# Altium schematic sheet Connectors.SchDoc
size Letter; Organization: Altium Limited; Address1: L3, 12a Rodborough Rd; Address2: Frenchs Forest; Address3: NSW; Address4: Australia 2086
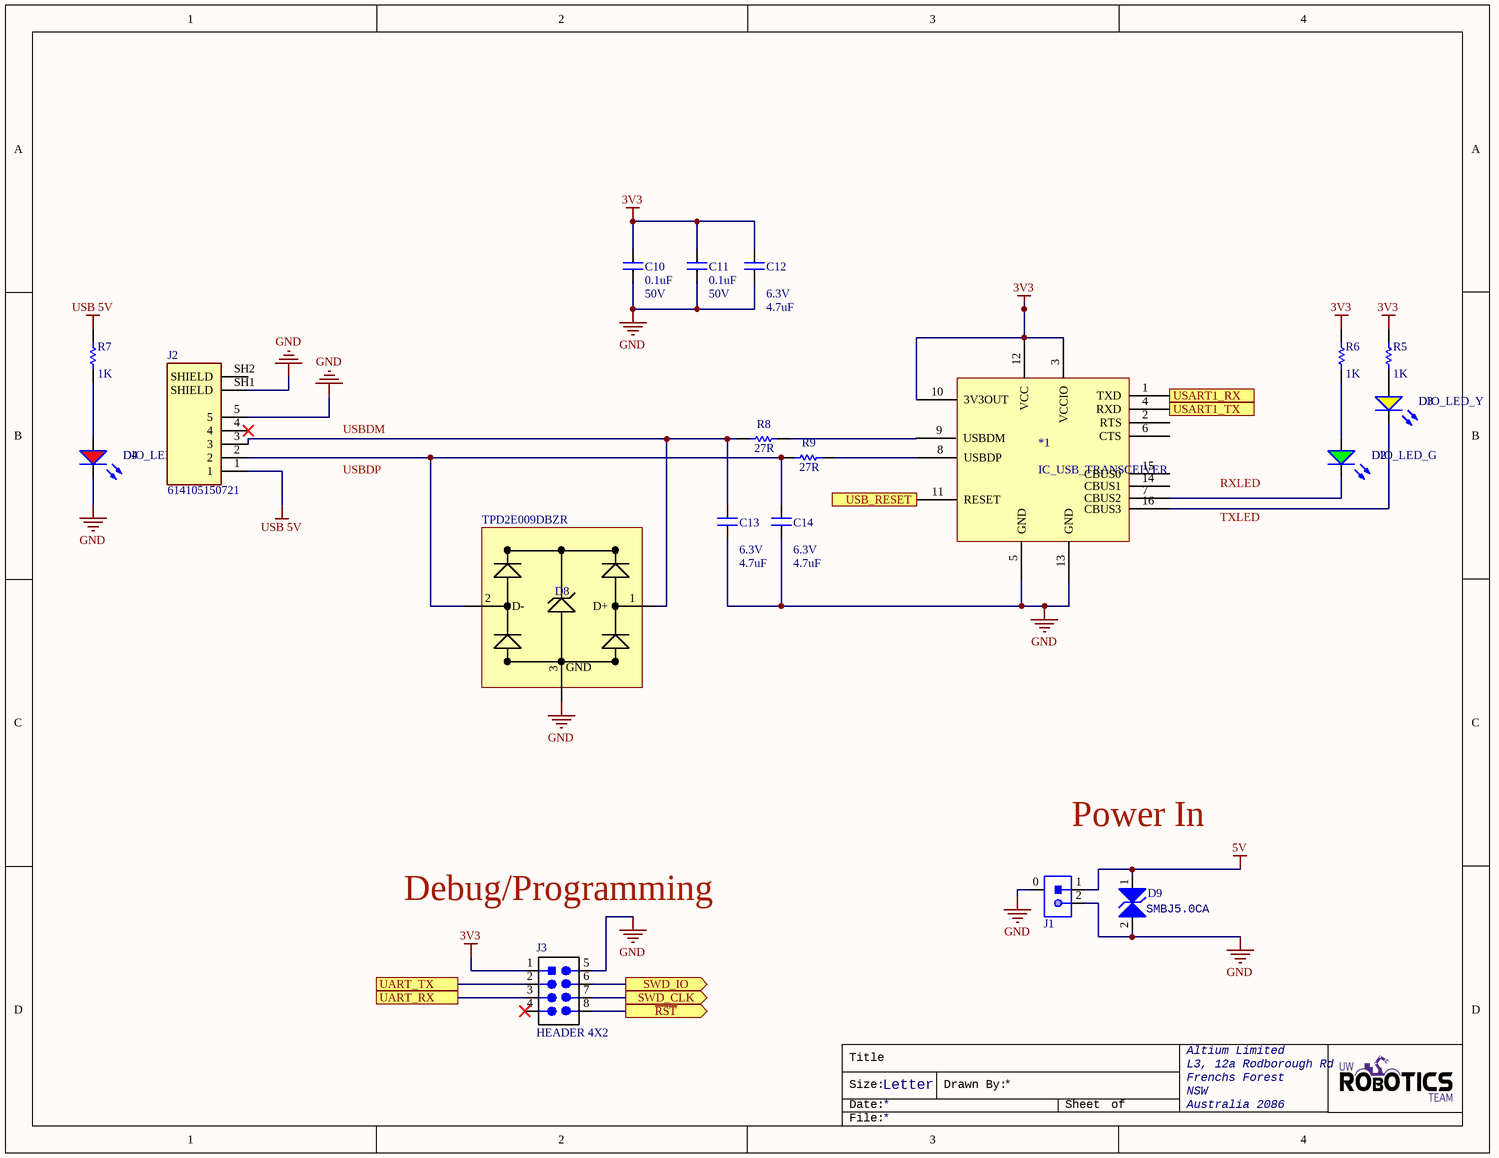
[diagram p0: Connectors.SchDoc]

## Parts
*1  IC_USB_TRANSCEIVER  [SSOP-16]
C10  value 0.1uF  Voltage Rating: 50V  [CAPC2012X140N]  (hidden comment: CAP_0.1uF_50V_0805)
C11  value 0.1uF  Voltage Rating: 50V  [CAPC2012X140N]  (hidden comment: CAP_0.1uF_50V_0805)
C12  value 4.7uF  Voltage Rating: 6.3V  [CAPC0603(1608)55_N]  (hidden comment: CAP_4.7uF_0603)
C13  value 4.7uF  Voltage Rating: 6.3V  [CAPC0603(1608)55_N]  (hidden comment: CAP_4.7uF_0603)
C14  value 4.7uF  Voltage Rating: 6.3V  [CAPC0603(1608)55_N]  (hidden comment: CAP_4.7uF_0603)
D2  DIO_LED_G  [LED_0805_LINE]
D3  DIO_LED_Y  [LED_0805_LINE]
D4  DIO_LED_R  [LED_0805_LINE]
D8  Manufacturer Part Number: TPD2E009DBZR  [SOT23-3]  (hidden comment: TVS_DIODE_USB_5.5V)
D9  Manufacturer Part Number 1: SMBJ5.0CA  [TVS_DIODE_BIDIRECTIONAL]  (hidden comment: TVS_DIODE_BIDIRECTIONAL)
J1  CON_2M_SM_RA  [MOLEX-5024940270]  (value not drawn)
J2  614105150721  [USB_CON]
J3  HEADER 4X2  [HEADER_2X4]
R5  value 1K  [RESC0603(1608)_N]  (hidden comment: RES_1K_0603)
R6  value 1K  [RESC0603(1608)_N]  (hidden comment: RES_1K_0603)
R7  value 1K  [RESC0603(1608)_N]  (hidden comment: RES_1K_0603)
R8  Resistance: 27R  [RESC0603(1608)_N]  (hidden comment: RES_27R_0603)
R9  Resistance: 27R  [RESC0603(1608)_N]  (hidden comment: RES_27R_0603)

## Ports
SWD_CLK (out), SWD_IO (out), UART_RX, UART_TX, USART1_RX, USART1_TX, USB_RESET, ~{RST} (out)

## Nets
3V3: *1.3(VCCIO) *1.10(3V3OUT) *1.12(VCC) C10.2 C11.2 C12.1 J3.1(VCC) R5.2 R6.2
5V: D9.1 J1.1
GND: *1.5(GND) *1.13(GND) C10.1 C11.1 C12.2 C13.1 C14.2 D4.2(K) D8.3(GND) D9.2 J1.0 J1.2 J2.5 J2.SH1(SHIELD) J3.5(GND)
USB 5V: J2.1 R7.2
~{RST}: J3.8 ; port ~{RST}
SWD_CLK: J3.7 ; port SWD_CLK
SWD_IO: J3.6 ; port SWD_IO
UART_RX: J3.3 ; port UART_RX
UART_TX: J3.2 ; port UART_TX
USART1_RX: *1.1(TXD) ; port USART1_RX
USART1_TX: *1.4(RXD) ; port USART1_TX
USB_RESET: *1.11(RESET) ; port USB_RESET
Net*1_7: *1.7(CBUS2) D2.2(K)
Net*1_8: *1.8(USBDP) R9.2
Net*1_16: *1.16(CBUS3) D3.2(K)
NetC13_2: C13.2 D8.1(D+) J2.3 R8.1
NetC14_1: C14.1 D8.2(D-) J2.2 R9.1
NetD2_1: D2.1(A) R6.1
NetD3_1: D3.1(A) R5.1
NetD4_1: D4.1(A) R7.1

Not connected (* = marked no-connect by the designer): *1 2(RTS) 6(CTS) 9(USBDM) 14(CBUS1) 15(CBUS0); J2 4* SH2(SHIELD); J3 4*; R8 2

## Notes on the sheet
- USBDM
- USBDP
- RXLED
- TXLED
- Power In
- Debug/Programming
- Title
- Size:
- Date:
- Letter
- Drawn By:
- Sheet
- of
- File:

## Library data of the parts
C10 C11 = CAP_0.1uF_50V_0805: CAP CER 0.1UF 50V X7R 0805; Manufacturer 1: Murata; Manufacturer Part Number 1: GCD21BR71H104KA01L; Capacitance: 100nF; Tolerance: 10%; Mount: Surface Mount; Case/Package: 0805; Case Code (Metric): 2012; Case Code (Imperial): 0805; Min Operating Temperature: -55°C; Max Operating Temperature: 125°C; Dielectric: X7R; Termination: SMD/SMT; Length: 2mm; Height: 1.25mm; Width: 0.049inch; Thickness: 0.049inch; Depth: 1.25mm; Ratings: AEC-Q200; ComponentLink1URL: https://datasheet.ciiva.com/29537/c03e-29537701.pdf?src-supplier=Digi-Key; ComponentLink1Description: https://datasheet.ciiva.com/29537/c03e-29537701.pdf?src-supplier=Digi-Key; Supplier 1: Digi-Key; Supplier Part Number 1: 490-11955-1-ND
C12-C14 = CAP_4.7uF_0603: CAP CER 4.7UF 6.3V X5R 0603; Manufacturer Part Number 1: CC0603KRX5R5BB475; Manufacturer 1: Yageo; Dimensions: 0.063" L x 0.031" W (1.60mm x 0.80mm); Package: 0603 (1608 Metric); Temperature Coefficient: X5R; Supplier Part Number 1: 311-1521-1-ND; Supplier 1: Digi-Key; Mount: Surface Mount
D2 = DIO_LED_G: LED GREEN DIFFUSED 0805 SMD; Manufacturer Part Number 1: LG R971-KN-1; Manufacturer 1: OSRAM; Forward Voltage Drop: 2.2V; Package: 0805 (2012 Metric); Supplier Part Number 1: 475-1410-1-ND; Supplier 1: Digi-Key; Mount: Surface Mount
D3 = DIO_LED_Y: LED YELLOW DIFFUSED 0805 SMD; Manufacturer Part Number 1: LY R976-PS-36; Manufacturer 1: OSRAM; Forward Voltage Drop: 2.2V; Package: 0805 (2012 Metric); Supplier Part Number 1: 475-2560-1-ND; Supplier 1: Digi-Key; Mount: Surface Mount
D4 = DIO_LED_R: LED RED DIFFUSED 0805 SMD; Manufacturer Part Number 1: LS R976-NR-1; Manufacturer 1: OSRAM; Forward Voltage Drop: 2V; Package: 0805 (2012 Metric); Supplier Part Number 1: 475-1278-1-ND; Supplier 1: Digi-Key; Mount: Surface Mount
D8 = TVS_DIODE_USB_5.5V: ESD Suppressor Diode Arrays 8KV 3-Pin SOT-23 T/R; Manufacturer: Texas Instruments; Direction: Unidirectional; Operating Supply Voltage: 6V; Capacitance: 0.9pF; Number of Channels: 2; Current Rating: 100nA; Peak Pulse Current: 1A; Element Configuration: Dual; Reverse Standoff Voltage: 5.5V; Min Breakdown Voltage: 9V; Clamping Voltage: 8V; Peak Pulse Power: 45W; Power Line Protection: Yes; Breakdown Voltage: 7V; Interface: LVDS,PCIe,SATA; Supplier 1: Digi-Key; RoHS: Yes; Category: Interface ICs; Stock 1: 98615; Pricing 1: 1=0.56000, 10=0.48000, 25=0.44800, 100=0.33280, 250=0.31616, 500=0.25984, 1000=0.21120 (USD); Case/Package: SOT-23; Number of Pins: 3; Min Operating Temperature: -40°C; Max Operating Temperature: 85°C; Packaging: Tape and Reel; Package Quantity: 1; Number of Bidirectional Channels: 2; Termination: SMD/SMT; Max Power Dissipation: 45W; Working Voltage: 5.5V; Length: 2.92mm; Height: 1mm; Width: 1.3mm; Depth: 1.3mm; Radiation Hardening: No; REACH SVHC: No SVHC; Lead Free: Lead Free; ComponentLink1URL: https://datasheet.ciiva.com/353/tpd2e009-353266.pdf?src-supplier=Digi-Key; ComponentLink1Description: https://datasheet.ciiva.com/353/tpd2e009-353266.pdf?src-supplier=Digi-Key; ComponentLink2URL: https://datasheet.ciiva.com/15134/getdatasheetpartid-243395-15134537.pdf?src-supplier=Verical; ComponentLink2Description: https://datasheet.ciiva.com/15134/getdatasheetpartid-243395-15134537.pdf?src-supplier=Verical; ComponentLink3URL: https://datasheet.ciiva.com/4479/slvs953a-121037-4479453.pdf?src-supplier=Mouser; ComponentLink3Description: https://datasheet.ciiva.com/4479/slvs953a-121037-4479453.pdf?src-supplier=Mouser; ComponentLink4URL: https://datasheet.ciiva.com/353/tpd2e009-353268.pdf?src-supplier=Digi-Key; ComponentLink4Description: https://datasheet.ciiva.com/353/tpd2e009-353268.pdf?src-supplier=Digi-Key; ComponentLink5URL: https://datasheet.ciiva.com/353/tpd2e009-353267.pdf?src-supplier=Digi-Key; ComponentLink5Description: https://datasheet.ciiva.com/353/tpd2e009-353267.pdf?src-supplier=Digi-Key; ComponentLink6URL: https://datasheet.ciiva.com/46384/1707898-46384524.pdf?src-supplier=Element14; ComponentLink6Description: https://datasheet.ciiva.com/46384/1707898-46384524.pdf?src-supplier=Element14; Supplier Part Number 1: 296-24657-1-ND
D9 = TVS_DIODE_BIDIRECTIONAL: TVS DIODE 5V 9.2V DO214AA; Manufacturer: Nexperia USA Inc.; Manufacturer 1: Littelfuse; Max Surge Current: 65.3A; Reverse Breakdown Voltage: 6.4V; Number of Elements: 1; Peak Pulse Power: 600W; Power Line Protection: No; Max Breakdown Voltage: 7V; Test Current: 10mA; ESD Protection: Yes; Max Reverse Leakage Current: 1.6mA; Max Power Dissipation: 5W; Element Configuration: Single; Package: SC-70, SOT-323; ComponentLink1Description: Datasheet; ComponentLink1URL: https://www.littelfuse.com/~/media/electronics/datasheets/tvs_diodes/littelfuse_tvs_diode_smbj_datasheet.pdf.pdf; Supplier Part Number 1: SMBJ5.0CALFCT-ND; Supplier 1: Digi-Key; Stock 1: 23233; Pricing 1: 1=0.39000, 10=0.31300, 25=0.28640, 100=0.17980, 250=0.17784, 500=0.16650, 1000=0.11322 (USD); Mount: Surface Mount; Case/Package: SMB; Number of Pins: 2; Min Operating Temperature: -65°C; Max Operating Temperature: 150°C; Direction: Bidirectional; Package Quantity: 3000; Packaging: Tape and Reel; Operating Supply Voltage: 5V; Number of Bidirectional Channels: 1; Reverse Standoff Voltage: 5V; Min Breakdown Voltage: 6.4V; Clamping Voltage: 9.2V; Breakdown Voltage: 6.4V; Number of Channels: 1; Polarity: Bidirectional; Power Dissipation: 600W; Peak Pulse Current: 65.3A; Leakage Current: 1.6mA; Voltage Rating (DC): 5V; Composition: Zener; Length: 0.179inch; Height: 0.096inch; Width: 0.155inch; Radiation Hardening: No; REACH SVHC: No SVHC; Lead Free: Lead Free
J1 = CON_2M_SM_RA: CONN HEADER SMD RIGHT ANGLE 2MM PITCH; Manufacturer 1: Molex; Manufacturer Part Number 1: 5024940270; Connector Type: Receptacle,Forked; Number of Positions: 2; Supplier 1: Digi-Key; Stock 1: 3397; Pricing 1: 1=0.53000, 10=0.49400, 25=0.44440, 50=0.39500, 100=0.37850, 250=0.34556 (USD); RoHS: No; Mount: Surface Mount; Contact Plating: Tin; Insulation Color: Natural; Insulation Material: Resin; Min Operating Temperature: -40°C; Max Operating Temperature: 105°C; Fastening Type: Latch; Packaging: Tape and Reel; Number of Rows: 1; Termination: Solder; Flammability Rating: UL94 V-0; ComponentLink1URL: https://www.molex.com/pdm_docs/as/AS-502439-002-001.pdf?src-supplier=Digi-Key; ComponentLink1Description: https://www.molex.com/pdm_docs/as/AS-502439-002-001.pdf?src-supplier=Digi-Key; Supplier Part Number 1: WM15810CT-ND
J2 = USB_CON: USB - micro B USB 2.0 Receptacle Connector 5 Position Through Hole; Manufacturer 1: Wurth Electronics; Package: None; Supplier Part Number 1: 732-5958-1-ND; Manufacturer Part Number 1: 614105150721; SnapEDA_Link: https://www.snapeda.com/parts/614105150721/Wurth%20Electronics%20Inc./view-part/1118291/?ref=snap; Value: *; Digi-Key_Purchase_URL: https://www.digikey.com/product-detail/en/w-rth-elektronik/614105150721/732-5958-1-ND/5047553?utm_source=snapeda&utm_medium=aggregator&utm_campaign=symbol; Supplier 1: Digi-Key
J3 = HEADER 4X2: CONN HEADER VERT 8POS 2.54MM; Manufacturer Part Number 1: M20-9980445; Manufacturer 1: Harwin Inc.; Supplier Part Number 1: 952-2122-ND; Supplier 1: Digi-Key; Mount: Through Hole
R5-R7 = RES_1K_0603: RES SMD 1K OHM 5% 1/10W 0603; Manufacturer 1: Yageo; Manufacturer Part Number 1: RC0603JR-071KL; Dimensions: 0.063" L x 0.031" W (1.60mm x 0.80mm); Tolerance: 5%; Package: 0603 (1608 Metric); Supplier Part Number 1: 311-1.0KGRCT-ND; Supplier 1: Digi-Key; Mount: Surface Mount
R8 R9 = RES_27R_0603: RES SMD 27 OHM 5% 1/10W 0603; Manufacturer: Yageo; Manufacturer Part Number: RC0603JR-0727RL; Voltage Rating (DC): 50V; Power Rating: 100mW; Temperature Coefficient: 100ppm/°C; Supplier 1: Digi-Key; RoHS: Yes; Category: Chip SMD Resistors; Stock 1: 2055343; Pricing 1: 1=0.10000, 10=0.01900, 100=0.00770, 1000=0.00347, 2500=0.00301 (USD); Case/Package: 0603; Number of Pins: 2; Case Code (Imperial): 0603; Case Code (Metric): 1608; Min Operating Temperature: -55°C; Max Operating Temperature: 155°C; Tolerance: 5%; Voltage Rating: 50V; Packaging: Tape and Reel; Termination: SMD/SMT; Composition: Thick Film; Military Standard: Not; Length: 1.6mm; Width: 0.8mm; Depth: 0.8mm; Lead Free: Lead Free; REACH SVHC: No SVHC; ComponentLink1URL: https://datasheet.ciiva.com/7746/443971-7746479.pdf?src-supplier=Element14; ComponentLink1Description: https://datasheet.ciiva.com/7746/443971-7746479.pdf?src-supplier=Element14; Supplier Part Number 1: 311-27GRCT-ND